# Altium schematic sheet Codec.SchDoc
size A4; SheetNumber: 3; SheetTotal: 6
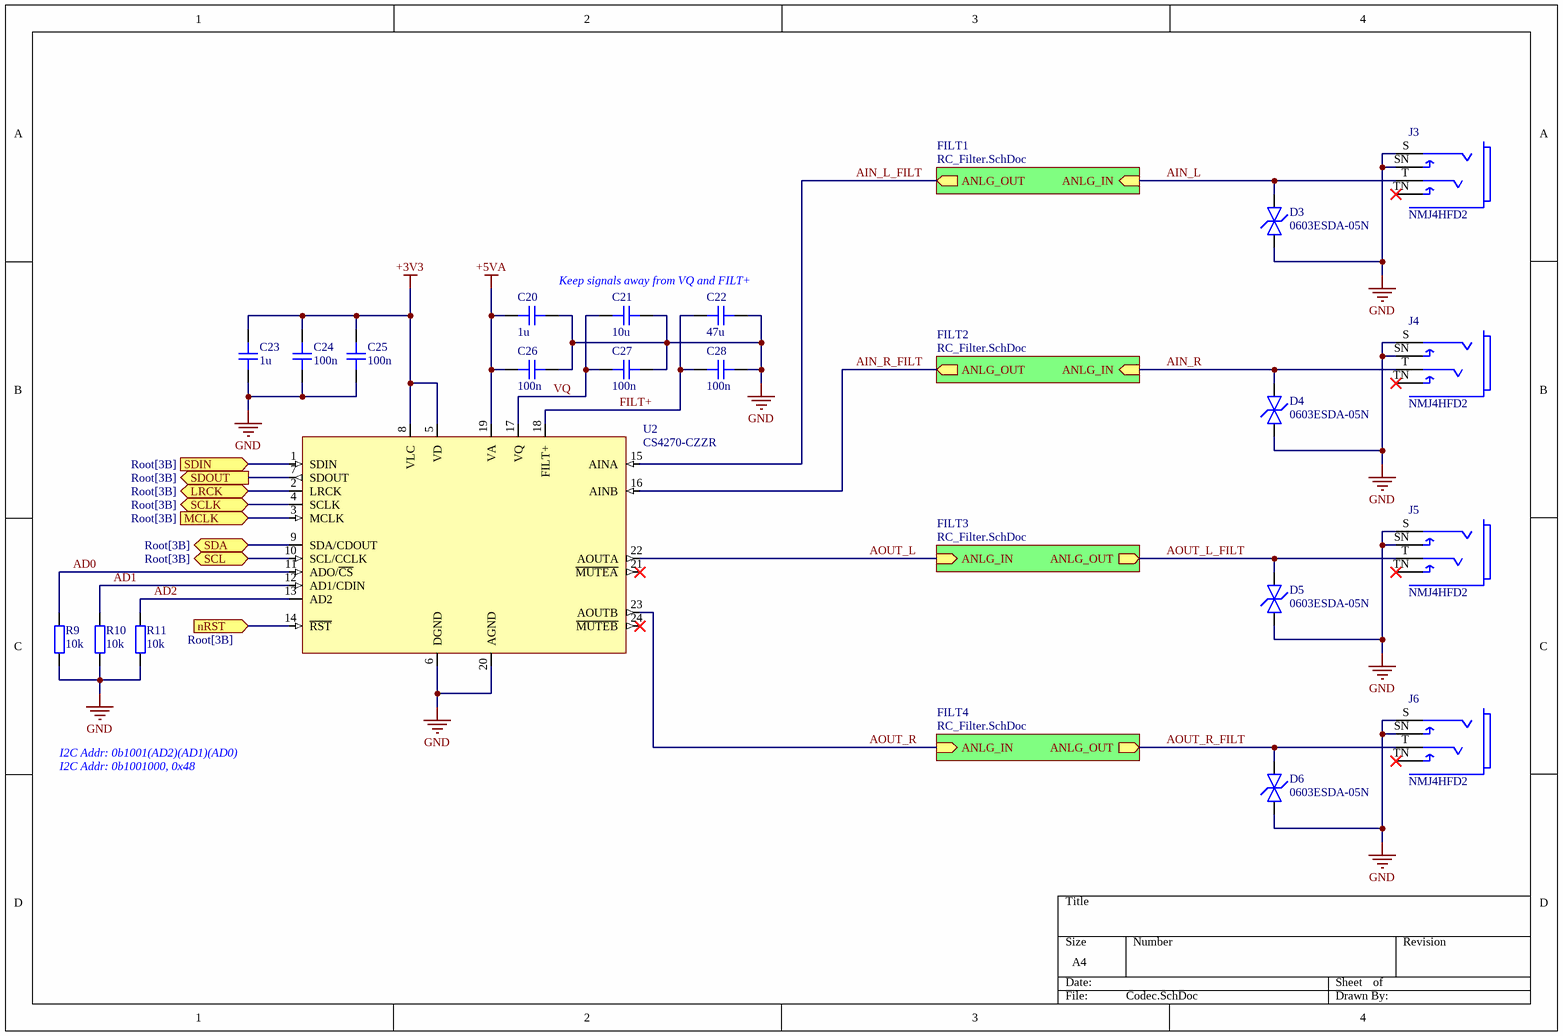
[diagram p0: Codec.SchDoc]

## Parts
C20  1u  [CAP_0603]
C21  10u  [CAP_1210]
C22  47u  [CAP_1210]
C23  1u  [CAP_0603]
C24  100n  [CAP_0603]
C25  100n  [CAP_0603]
C26  100n  [CAP_0603]
C27  100n  [CAP_0603]
C28  100n  [CAP_0603]
D3  0603ESDA-05N  [D_0603]
D4  0603ESDA-05N  [D_0603]
D5  0603ESDA-05N  [D_0603]
D6  0603ESDA-05N  [D_0603]
J3  NMJ4HFD2  [FP-NMJ4HFD2-MFG]
J4  NMJ4HFD2  [FP-NMJ4HFD2-MFG]
J5  NMJ4HFD2  [FP-NMJ4HFD2-MFG]
J6  NMJ4HFD2  [FP-NMJ4HFD2-MFG]
R9  10k  [RES_0603]
R10  10k  [RES_0603]
R11  10k  [RES_0603]
U2  CS4270-CZZR  [TSSOP-24]

## Sub-sheets
FILT1 = RC_Filter.SchDoc: ANLG_IN (in), ANLG_OUT (out)
FILT2 = RC_Filter.SchDoc: ANLG_IN (in), ANLG_OUT (out)
FILT3 = RC_Filter.SchDoc: ANLG_IN (in), ANLG_OUT (out)
FILT4 = RC_Filter.SchDoc: ANLG_IN (in), ANLG_OUT (out)

## Ports
LRCK (bidir, see Root[3B]), MCLK (in, see Root[3B]), nRST (in, see Root[3B]), SCL (bidir, see Root[3B]), SCLK (bidir, see Root[3B]), SDA (bidir, see Root[3B]), SDIN (in, see Root[3B]), SDOUT (out, see Root[3B])

## Nets
+3V3: C23.2 C24.1 C25.1 U2.5(VD) U2.8(VLC)
+5VA: C20.1 C26.2 U2.19(VA)
GND: C20.2 C21.2 C22.2 C23.1 C24.2 C25.2 C26.1 C27.2 C28.2 D3.A D4.A D5.A D6.A J3.S J3.SN J4.S J4.SN J5.S J5.SN J6.S J6.SN R9.1 R10.1 R11.1 U2.6(DGND) U2.20(AGND)
AD0: R9.2 U2.11(ADO/~{CS})
AD1: R10.2 U2.12(AD1/CDIN)
AD2: R11.2 U2.13(AD2)
AIN_L: D3.K J3.T ; sheet FILT1/ANLG_IN
AIN_L_FILT: U2.15(AINA) ; sheet FILT1/ANLG_OUT
AIN_R: D4.K J4.T ; sheet FILT2/ANLG_IN
AIN_R_FILT: U2.16(AINB) ; sheet FILT2/ANLG_OUT
AOUT_L: U2.22(AOUTA) ; sheet FILT3/ANLG_IN
AOUT_L_FILT: D5.K J5.T ; sheet FILT3/ANLG_OUT
AOUT_R: U2.23(AOUTB) ; sheet FILT4/ANLG_IN
AOUT_R_FILT: D6.K J6.T ; sheet FILT4/ANLG_OUT
FILT+: C22.1 C28.1 U2.18(FILT+)
LRCK: U2.2(LRCK) ; port LRCK
MCLK: U2.3(MCLK) ; port MCLK
nRST: U2.14(~{RST}) ; port nRST
SCL: U2.10(SCL/CCLK) ; port SCL
SCLK: U2.4(SCLK) ; port SCLK
SDA: U2.9(SDA/CDOUT) ; port SDA
SDIN: U2.1(SDIN) ; port SDIN
SDOUT: U2.7(SDOUT) ; port SDOUT
VQ: C21.1 C27.1 U2.17(VQ)

Not connected (* = marked no-connect by the designer): J3 TN*; J4 TN*; J5 TN*; J6 TN*; U2 21(~{MUTEA})* 24(~{MUTEB})*

## Notes on the sheet
- Keep signals away from VQ and FILT+
- I2C Addr: 0b1001(AD2)(AD1)(AD0)
- I2C Addr: 0b1001000, 0x48

## Library data of the parts
C20 C23-C28 = CAP_0603: Capacitor SMD 0603; Manufacturer: *; Manufacturer Part Number: *; Distributor Link: *; LCSC: *; Rating: *; Dielectric: *
C21 C22 = CAP_1210: Capacitor SMD 1210; Manufacturer: *; Manufacturer Part Number: *; Distributor Link: *; LCSC: *; Rating: *; Dielectric: *
D3-D6 = D_TVS_BI_0603: Diode TVS / ESD Bidirectional 0603; Manufacturer: *; Manufacturer Part Number: *
J3-J6 = CMP-78736-000001-1: Conn 1/4" Mono Jack F 3 POS Solder RA Thru-Hole 3 Terminal 1 Port; Manufacturer: Neutrik; Number Of Contacts: 2; Current Rating: 0.5A; Voltage Rating: 50V; Conn Orientation: Horizontal; Is Female: yes; Temperature: -25°C to +70°C; ComponentLink2Description: Datasheet; ComponentLink2URL: https://www.neutrik.com/en/product/nmj4hfd2.pdf; Contact Material: Silver; Height: 15.89mm; Package: 0; Mouser Description: Phone Audio Connector, Socket, 2, PCB Mount, Metal Body, Silver Plated Contacts; Manufacturer Part Number: NMJ4HFD2; Automotive: No; RoHS: TRUE; Lead Free: Yes; Device Class L2: Audio / Video Connectors; Device Class L3: unset; Temperature Range Low: -25°C; Category: Conn; Footprint Url: https://www.neutrik.com/media/8576/download/st-nmj4hfd2.pdf?v=1; Temperature Range High: +70°C; Device Class L1: Connectors; Octopart: https://octopart.com/nmj4hfd2-neutrik-758952
R9-R11 = RES_0603: Resistor SMD 0603; Manufacturer: *; Manufacturer Part Number: *; Distributor Link: *; LCSC: *
U2 = CS4270-CZZR: 24-Bit 192kHz Stereo Audio Codec TSSOP-24; Manufacturer: Cirrus Logic; Manufacturer Part Number: CS4270-CZZR